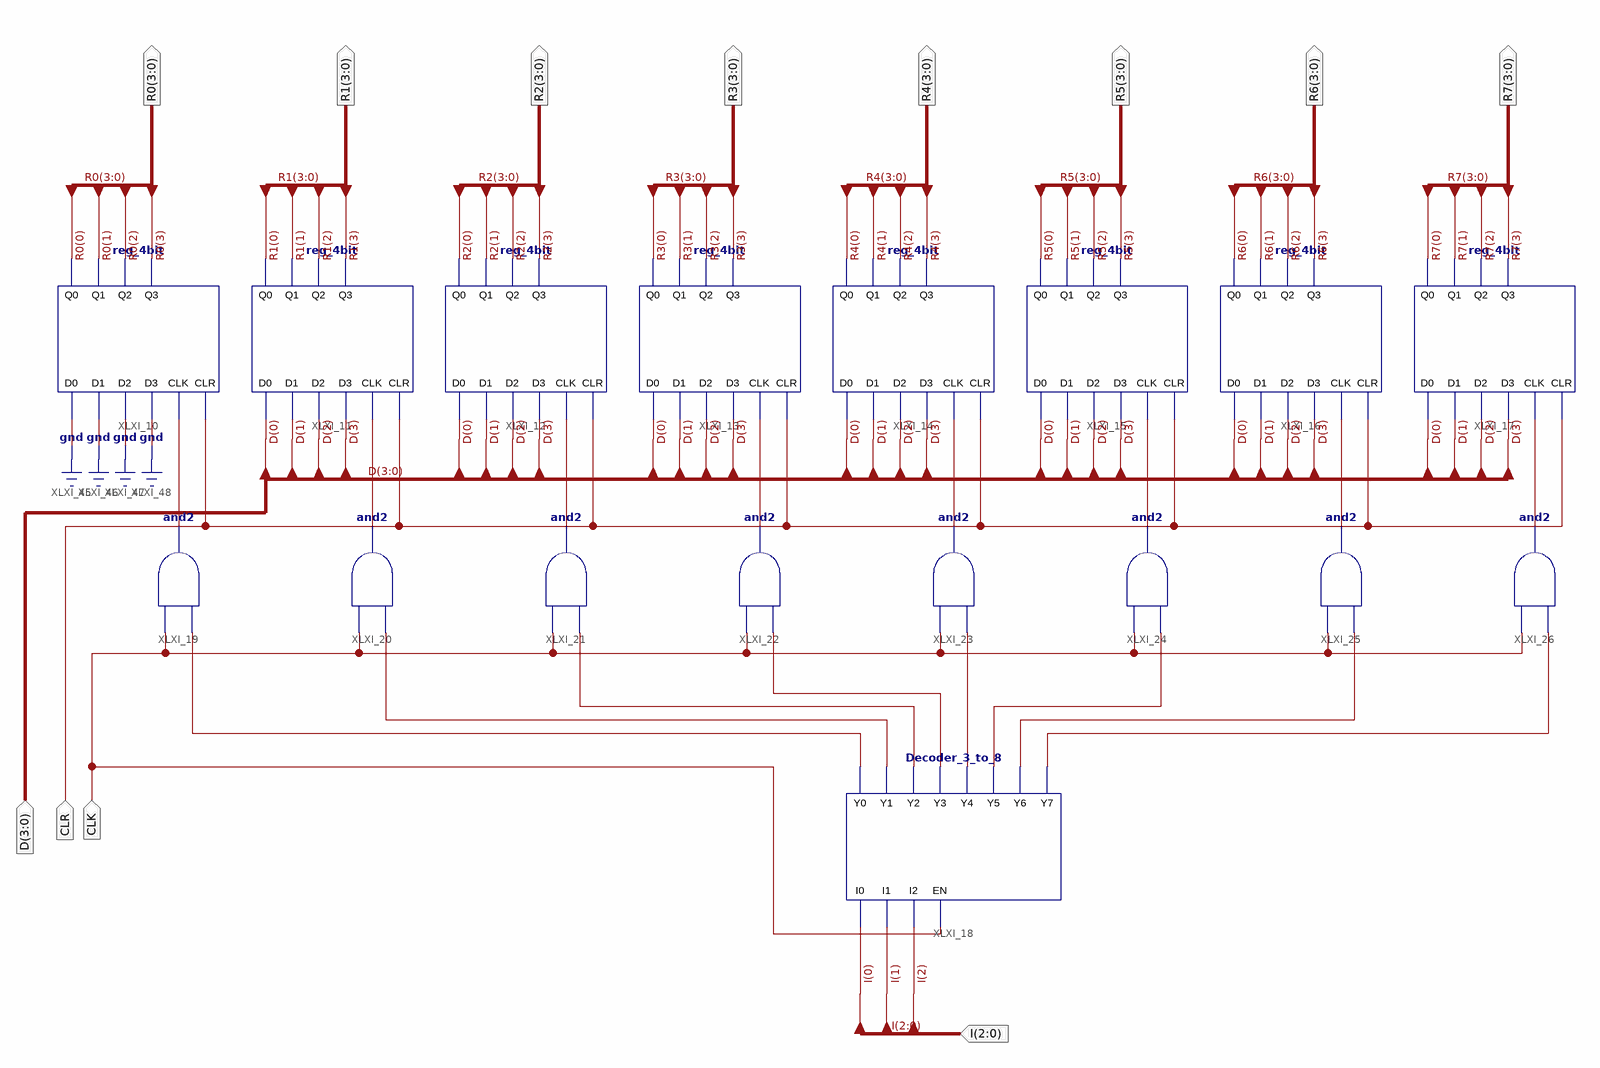
[diagram p0: schematic sheet 1]
// Xilinx ISE schematic regBank.sch (spartan3e) as structural Verilog: 17 symbols, 12 ports
module regBank (
  input  CLR,
  input  [3:0] D,
  input  CLK,
  input  [2:0] I,
  output [3:0] R1,
  output [3:0] R0,
  output [3:0] R2,
  output [3:0] R3,
  output [3:0] R4,
  output [3:0] R5,
  output [3:0] R6,
  output [3:0] R7
);

  wire XLXN_1, XLXN_2, XLXN_3, XLXN_4, XLXN_5, XLXN_6, XLXN_7, XLXN_8, XLXN_9, XLXN_10, XLXN_11, XLXN_16,
       XLXN_17, XLXN_19, XLXN_20, XLXN_21;

  reg_4bit XLXI_10 (
    .CLK(XLXN_1), .CLR(CLR), .D0(1'b0), .D1(1'b0), .D2(1'b0), .D3(1'b0), .Q0(R0[0]), .Q1(R0[1]), .Q2(R0[2]),
    .Q3(R0[3]));
  reg_4bit XLXI_11 (
    .CLK(XLXN_2), .CLR(CLR), .D0(D[0]), .D1(D[1]), .D2(D[2]), .D3(D[3]), .Q0(R1[0]), .Q1(R1[1]), .Q2(R1[2]),
    .Q3(R1[3]));
  reg_4bit XLXI_12 (
    .CLK(XLXN_3), .CLR(CLR), .D0(D[0]), .D1(D[1]), .D2(D[2]), .D3(D[3]), .Q0(R2[0]), .Q1(R2[1]), .Q2(R2[2]),
    .Q3(R2[3]));
  reg_4bit XLXI_13 (
    .CLK(XLXN_4), .CLR(CLR), .D0(D[0]), .D1(D[1]), .D2(D[2]), .D3(D[3]), .Q0(R3[0]), .Q1(R3[1]), .Q2(R3[2]),
    .Q3(R3[3]));
  reg_4bit XLXI_14 (
    .CLK(XLXN_5), .CLR(CLR), .D0(D[0]), .D1(D[1]), .D2(D[2]), .D3(D[3]), .Q0(R4[0]), .Q1(R4[1]), .Q2(R4[2]),
    .Q3(R4[3]));
  reg_4bit XLXI_15 (
    .CLK(XLXN_6), .CLR(CLR), .D0(D[0]), .D1(D[1]), .D2(D[2]), .D3(D[3]), .Q0(R5[0]), .Q1(R5[1]), .Q2(R5[2]),
    .Q3(R5[3]));
  reg_4bit XLXI_16 (
    .CLK(XLXN_7), .CLR(CLR), .D0(D[0]), .D1(D[1]), .D2(D[2]), .D3(D[3]), .Q0(R6[0]), .Q1(R6[1]), .Q2(R6[2]),
    .Q3(R6[3]));
  reg_4bit XLXI_17 (
    .CLK(XLXN_8), .CLR(CLR), .D0(D[0]), .D1(D[1]), .D2(D[2]), .D3(D[3]), .Q0(R7[0]), .Q1(R7[1]), .Q2(R7[2]),
    .Q3(R7[3]));
  and XLXI_19 (XLXN_1, XLXN_9, CLK);
  and XLXI_20 (XLXN_2, XLXN_10, CLK);
  and XLXI_21 (XLXN_3, XLXN_11, CLK);
  and XLXI_22 (XLXN_4, XLXN_16, CLK);
  and XLXI_23 (XLXN_5, XLXN_17, CLK);
  and XLXI_24 (XLXN_6, XLXN_21, CLK);
  and XLXI_25 (XLXN_7, XLXN_20, CLK);
  and XLXI_26 (XLXN_8, XLXN_19, CLK);
  Decoder_3_to_8 XLXI_18 (
    .EN(CLK), .I0(I[0]), .I1(I[1]), .I2(I[2]), .Y0(XLXN_9), .Y1(XLXN_10), .Y2(XLXN_11), .Y3(XLXN_16),
    .Y4(XLXN_17), .Y5(XLXN_21), .Y6(XLXN_20), .Y7(XLXN_19));
endmodule
